# EAGLE schematic tester (EAGLE 6.6.0)

## Sheet 1 of 3
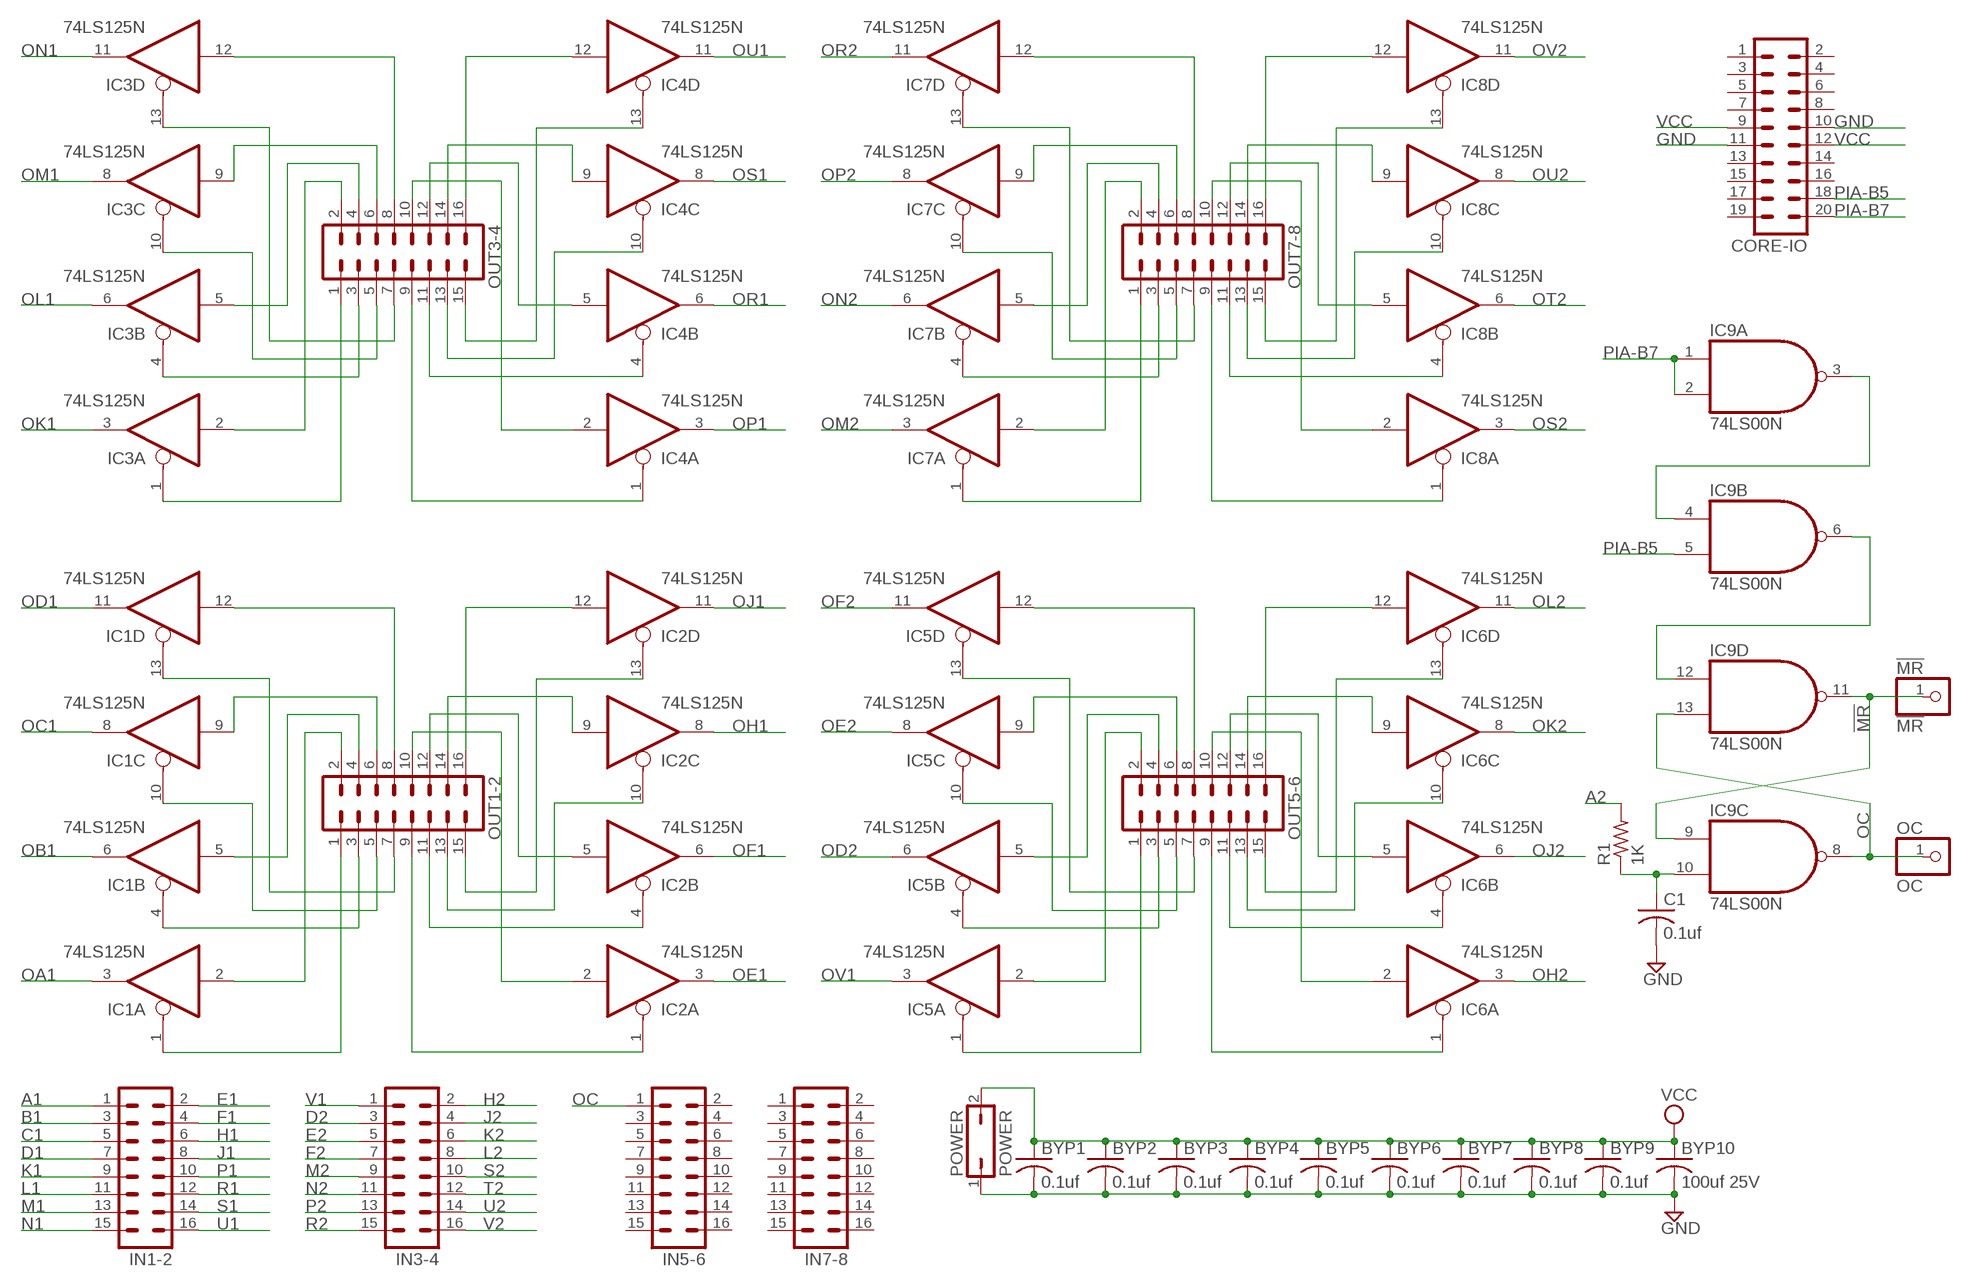
[diagram p0: schematic, sheet 1]

### Parts
!MR  !MR  PINHD-1X1  [1X01]
BYP1  0.1uf  C-US050-025X075  [C050-025X075]
BYP2  0.1uf  C-US050-025X075  [C050-025X075]
BYP3  0.1uf  C-US050-025X075  [C050-025X075]
BYP4  0.1uf  C-US050-025X075  [C050-025X075]
BYP5  0.1uf  C-US050-025X075  [C050-025X075]
BYP6  0.1uf  C-US050-025X075  [C050-025X075]
BYP7  0.1uf  C-US050-025X075  [C050-025X075]
BYP8  0.1uf  C-US050-025X075  [C050-025X075]
BYP9  0.1uf  C-US050-025X075  [C050-025X075]
BYP10  100uf 25V  C-US150-064X183  [C150-064X183]
C1  0.1uf  C-US050-025X075  [C050-025X075]
CORE-IO  MA10-2  [MA10-2]
IC1  74LS125N  [DIL14]
IC2  74LS125N  [DIL14]
IC3  74LS125N  [DIL14]
IC4  74LS125N  [DIL14]
IC5  74LS125N  [DIL14]
IC6  74LS125N  [DIL14]
IC7  74LS125N  [DIL14]
IC8  74LS125N  [DIL14]
IC9  74LS00N  [DIL14]
IN1-2  MA08-2  [MA08-2]
IN3-4  MA08-2  [MA08-2]
IN5-6  MA08-2  [MA08-2]
IN7-8  MA08-2  [MA08-2]
OC  OC  PINHD-1X1  [1X01]
OUT1-2  MA08-2  [MA08-2]
OUT3-4  MA08-2  [MA08-2]
OUT5-6  MA08-2  [MA08-2]
OUT7-8  MA08-2  [MA08-2]
POWER  POWER  JP1Q  [JP1]
R1  1K  R-US_0207/10  [0207/10]

### Nets
!MR: !MR.1 IC9.9(C:I0) IC9.11(D:O)
A1: IN1-2.1 ; also sheet 3
A2: R1.2 ; also sheet 3
B1: IN1-2.3 ; also sheet 3
C1: IN1-2.5 ; also sheet 3
D1: IN1-2.7 ; also sheet 3
D2: IN3-4.3 ; also sheet 3
E1: IN1-2.2 ; also sheet 3
E2: IN3-4.5 ; also sheet 3
F1: IN1-2.4 ; also sheet 3
F2: IN3-4.7 ; also sheet 3
GND [Power]: BYP1.2 BYP2.2 BYP3.2 BYP4.2 BYP5.2 BYP6.2 BYP7.2 BYP8.2 BYP9.2 BYP10.2 C1.2 CORE-IO.10 CORE-IO.11 POWER.1 ; also sheet 3
H1: IN1-2.6 ; also sheet 3
H2: IN3-4.2 ; also sheet 3
J1: IN1-2.8 ; also sheet 3
J2: IN3-4.4 ; also sheet 3
K1: IN1-2.9 ; also sheet 3
K2: IN3-4.6 ; also sheet 3
L1: IN1-2.11 ; also sheet 3
L2: IN3-4.8 ; also sheet 3
M1: IN1-2.13 ; also sheet 3
M2: IN3-4.9 ; also sheet 3
N1: IN1-2.15 ; also sheet 3
N2: IN3-4.11 ; also sheet 3
N$1: IC9.6(B:O) IC9.12(D:I0)
N$2: IC9.3(A:O) IC9.4(B:I0)
N$5: C1.1 IC9.10(C:I1) R1.1
N$53: IC1.1(A:OE) OUT1-2.1
N$54: IC1.4(B:OE) OUT1-2.3
N$55: IC1.10(C:OE) OUT1-2.5
N$56: IC1.13(D:OE) OUT1-2.7
N$57: IC1.2(A:I) OUT1-2.2
N$58: IC1.5(B:I) OUT1-2.4
N$59: IC1.9(C:I) OUT1-2.6
N$60: IC1.12(D:I) OUT1-2.8
N$61: IC5.4(B:OE) OUT5-6.3
N$62: IC2.10(C:OE) OUT1-2.13
N$63: IC2.4(B:OE) OUT1-2.11
N$64: IC2.1(A:OE) OUT1-2.9
N$65: IC2.2(A:I) OUT1-2.10
N$66: IC2.5(B:I) OUT1-2.12
N$67: IC2.9(C:I) OUT1-2.14
N$68: IC2.12(D:I) OUT1-2.16
N$138: IC5.13(D:OE) OUT5-6.7
N$139: IC2.13(D:OE) OUT1-2.15
N$140: IC5.2(A:I) OUT5-6.2
N$141: IC5.5(B:I) OUT5-6.4
N$142: IC5.9(C:I) OUT5-6.6
N$143: IC5.12(D:I) OUT5-6.8
N$144: IC6.10(C:OE) OUT5-6.13
N$145: IC6.4(B:OE) OUT5-6.11
N$146: IC6.1(A:OE) OUT5-6.9
N$147: IC6.2(A:I) OUT5-6.10
N$148: IC6.9(C:I) OUT5-6.14
N$149: IC6.12(D:I) OUT5-6.16
N$150: IC5.1(A:OE) OUT5-6.1
N$151: IC5.10(C:OE) OUT5-6.5
N$152: IC6.5(B:I) OUT5-6.12
N$153: IC6.13(D:OE) OUT5-6.15
N$154: IC3.4(B:OE) OUT3-4.3
N$155: IC3.13(D:OE) OUT3-4.7
N$156: IC3.2(A:I) OUT3-4.2
N$157: IC3.5(B:I) OUT3-4.4
N$158: IC3.9(C:I) OUT3-4.6
N$159: IC3.12(D:I) OUT3-4.8
N$160: IC4.10(C:OE) OUT3-4.13
N$161: IC4.4(B:OE) OUT3-4.11
N$162: IC4.1(A:OE) OUT3-4.9
N$163: IC4.2(A:I) OUT3-4.10
N$164: IC4.9(C:I) OUT3-4.14
N$165: IC4.12(D:I) OUT3-4.16
N$166: IC3.1(A:OE) OUT3-4.1
N$167: IC3.10(C:OE) OUT3-4.5
N$168: IC4.5(B:I) OUT3-4.12
N$169: IC4.13(D:OE) OUT3-4.15
N$170: IC7.4(B:OE) OUT7-8.3
N$171: IC7.13(D:OE) OUT7-8.7
N$172: IC7.2(A:I) OUT7-8.2
N$173: IC7.5(B:I) OUT7-8.4
N$174: IC7.9(C:I) OUT7-8.6
N$175: IC7.12(D:I) OUT7-8.8
N$176: IC8.10(C:OE) OUT7-8.13
N$177: IC8.4(B:OE) OUT7-8.11
N$178: IC8.1(A:OE) OUT7-8.9
N$179: IC8.2(A:I) OUT7-8.10
N$180: IC8.9(C:I) OUT7-8.14
N$181: IC8.12(D:I) OUT7-8.16
N$182: IC7.1(A:OE) OUT7-8.1
N$183: IC7.10(C:OE) OUT7-8.5
N$184: IC8.5(B:I) OUT7-8.12
N$185: IC8.13(D:OE) OUT7-8.15
OA1: IC1.3(A:O) ; also sheet 3
OB1: IC1.6(B:O) ; also sheet 3
OC: IC9.8(C:O) IC9.13(D:I1) IN5-6.1 OC.1
OC1: IC1.8(C:O) ; also sheet 3
OD1: IC1.11(D:O) ; also sheet 3
OD2: IC5.6(B:O) ; also sheet 3
OE1: IC2.3(A:O) ; also sheet 3
OE2: IC5.8(C:O) ; also sheet 3
OF1: IC2.6(B:O) ; also sheet 3
OF2: IC5.11(D:O) ; also sheet 3
OH1: IC2.8(C:O) ; also sheet 3
OH2: IC6.3(A:O) ; also sheet 3
OJ1: IC2.11(D:O) ; also sheet 3
OJ2: IC6.6(B:O) ; also sheet 3
OK1: IC3.3(A:O) ; also sheet 3
OK2: IC6.8(C:O) ; also sheet 3
OL1: IC3.6(B:O) ; also sheet 3
OL2: IC6.11(D:O) ; also sheet 3
OM1: IC3.8(C:O) ; also sheet 3
OM2: IC7.3(A:O) ; also sheet 3
ON1: IC3.11(D:O) ; also sheet 3
ON2: IC7.6(B:O) ; also sheet 3
OP1: IC4.3(A:O) ; also sheet 3
OP2: IC7.8(C:O) ; also sheet 3
OR1: IC4.6(B:O) ; also sheet 3
OR2: IC7.11(D:O) ; also sheet 3
OS1: IC4.8(C:O) ; also sheet 3
OS2: IC8.3(A:O) ; also sheet 3
OT2: IC8.6(B:O) ; also sheet 3
OU1: IC4.11(D:O) ; also sheet 3
OU2: IC8.8(C:O) ; also sheet 3
OV1: IC5.3(A:O) ; also sheet 3
OV2: IC8.11(D:O) ; also sheet 3
P1: IN1-2.10 ; also sheet 3
P2: IN3-4.13 ; also sheet 3
PIA-B5: CORE-IO.18 IC9.5(B:I1)
PIA-B7: CORE-IO.20 IC9.1(A:I0) IC9.2(A:I1)
R1: IN1-2.12 ; also sheet 3
R2: IN3-4.15 ; also sheet 3
S1: IN1-2.14 ; also sheet 3
S2: IN3-4.10 ; also sheet 3
T2: IN3-4.12 ; also sheet 3
U1: IN1-2.16 ; also sheet 3
U2: IN3-4.14 ; also sheet 3
V1: IN3-4.1 ; also sheet 3
V2: IN3-4.16 ; also sheet 3
VCC [Power]: BYP1.1 BYP2.1 BYP3.1 BYP4.1 BYP5.1 BYP6.1 BYP7.1 BYP8.1 BYP9.1 BYP10.1 CORE-IO.9 CORE-IO.12 POWER.2 ; also sheet 3
Unconnected: CORE-IO.1 CORE-IO.2 CORE-IO.3 CORE-IO.4 CORE-IO.5 CORE-IO.6 CORE-IO.7 CORE-IO.8 CORE-IO.13 CORE-IO.14 CORE-IO.15 CORE-IO.16 CORE-IO.17 CORE-IO.19 IN5-6.2 IN5-6.3 IN5-6.4 IN5-6.5 IN5-6.6 IN5-6.7 IN5-6.8 IN5-6.9 IN5-6.10 IN5-6.11 IN5-6.12 IN5-6.13 IN5-6.14 IN5-6.15 IN5-6.16 IN7-8.1 IN7-8.2 IN7-8.3 IN7-8.4 IN7-8.5 IN7-8.6 IN7-8.7 IN7-8.8 IN7-8.9 IN7-8.10 IN7-8.11 IN7-8.12 IN7-8.13 IN7-8.14 IN7-8.15 IN7-8.16

## Sheet 2 of 3
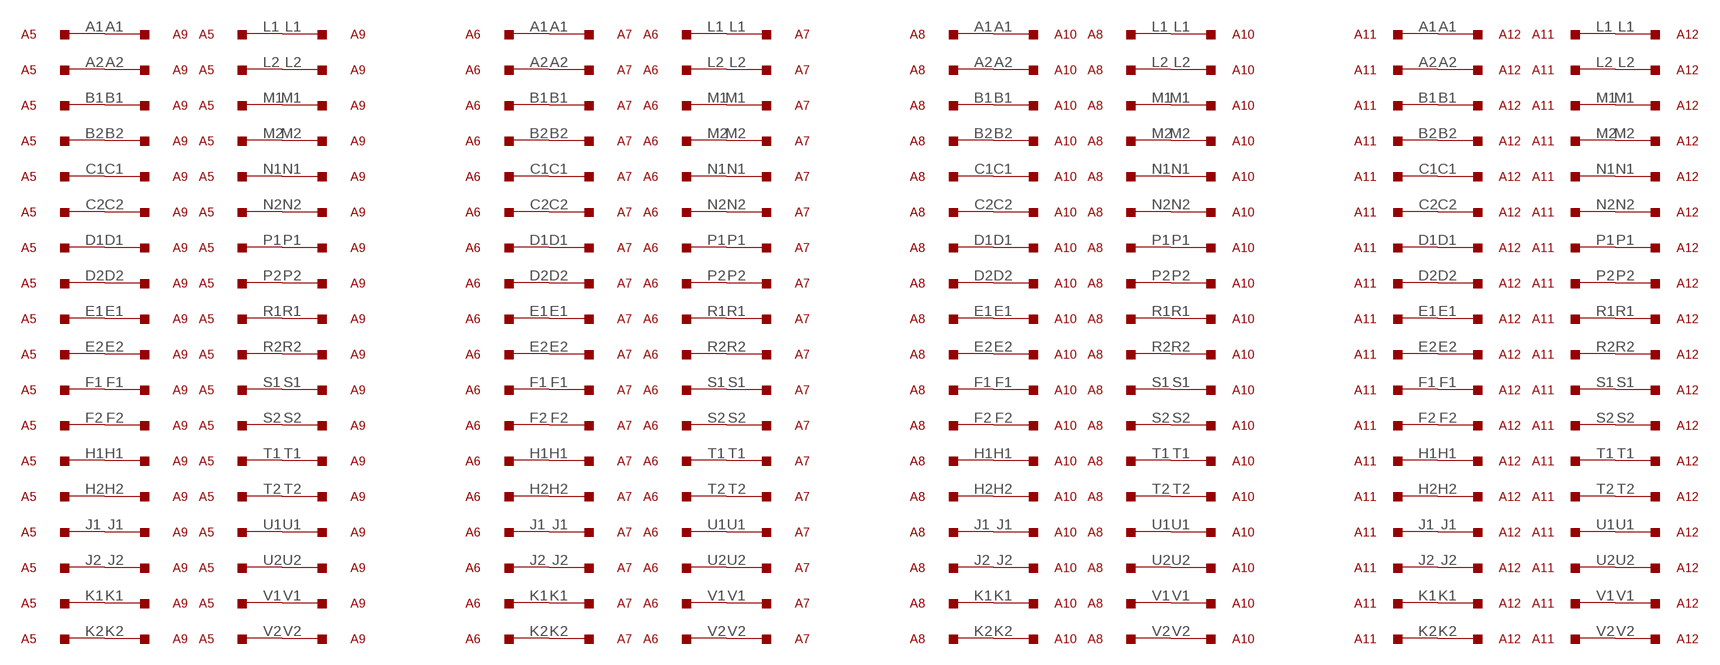
[diagram p1: schematic, sheet 2]

### Parts
A5  M916  [H807]
A6  M916  [H807]
A7  M916  [H807]
A8  M916  [H807]
A9  M916  [H807]
A10  M916  [H807]
A11  M916  [H807]
A12  M916  [H807]

### Nets
N$26: A5.L1 A9.L1
N$33: A5.L2 A9.L2
N$34: A5.M1 A9.M1
N$35: A5.M2 A9.M2
N$36: A5.N1 A9.N1
N$49: A5.N2 A9.N2
N$50: A5.P1 A9.P1
N$51: A5.P2 A9.P2
N$52: A5.R1 A9.R1
N$69: A5.R2 A9.R2
N$70: A5.S1 A9.S1
N$71: A5.S2 A9.S2
N$72: A5.T1 A9.T1
N$73: A5.T2 A9.T2
N$74: A5.U1 A9.U1
N$75: A5.U2 A9.U2
N$76: A5.V1 A9.V1
N$81: A5.V2 A9.V2
N$82: A5.A1 A9.A1
N$83: A5.A2 A9.A2
N$84: A5.B1 A9.B1
N$85: A5.B2 A9.B2
N$86: A5.C1 A9.C1
N$87: A5.C2 A9.C2
N$88: A5.D1 A9.D1
N$89: A5.D2 A9.D2
N$90: A5.E1 A9.E1
N$91: A5.E2 A9.E2
N$92: A5.F1 A9.F1
N$93: A5.F2 A9.F2
N$95: A5.H1 A9.H1
N$96: A5.H2 A9.H2
N$97: A5.J1 A9.J1
N$98: A5.J2 A9.J2
N$99: A5.K1 A9.K1
N$100: A5.K2 A9.K2
N$113: A6.L1 A7.L1
N$114: A6.L2 A7.L2
N$115: A6.M1 A7.M1
N$116: A6.M2 A7.M2
N$117: A6.N1 A7.N1
N$118: A6.N2 A7.N2
N$119: A6.P1 A7.P1
N$120: A6.P2 A7.P2
N$121: A6.R1 A7.R1
N$122: A6.R2 A7.R2
N$123: A6.S1 A7.S1
N$137: A6.S2 A7.S2
N$186: A6.T1 A7.T1
N$187: A6.T2 A7.T2
N$188: A6.U1 A7.U1
N$189: A6.U2 A7.U2
N$190: A6.V1 A7.V1
N$191: A6.V2 A7.V2
N$192: A6.A1 A7.A1
N$193: A6.A2 A7.A2
N$194: A6.B1 A7.B1
N$195: A6.B2 A7.B2
N$196: A6.C1 A7.C1
N$197: A6.C2 A7.C2
N$198: A6.D1 A7.D1
N$199: A6.D2 A7.D2
N$200: A6.E1 A7.E1
N$201: A6.E2 A7.E2
N$202: A6.F1 A7.F1
N$203: A6.F2 A7.F2
N$204: A6.H1 A7.H1
N$205: A6.H2 A7.H2
N$206: A6.J1 A7.J1
N$207: A6.J2 A7.J2
N$208: A6.K1 A7.K1
N$209: A6.K2 A7.K2
N$210: A8.L1 A10.L1
N$211: A8.L2 A10.L2
N$212: A8.M1 A10.M1
N$213: A8.M2 A10.M2
N$214: A8.N1 A10.N1
N$215: A8.N2 A10.N2
N$216: A8.P1 A10.P1
N$217: A8.P2 A10.P2
N$218: A8.R1 A10.R1
N$219: A8.R2 A10.R2
N$220: A8.S1 A10.S1
N$221: A8.S2 A10.S2
N$222: A8.T1 A10.T1
N$223: A8.T2 A10.T2
N$224: A8.U1 A10.U1
N$225: A8.U2 A10.U2
N$226: A8.V1 A10.V1
N$227: A8.V2 A10.V2
N$228: A8.A1 A10.A1
N$229: A8.A2 A10.A2
N$230: A8.B1 A10.B1
N$231: A8.B2 A10.B2
N$232: A8.C1 A10.C1
N$233: A8.C2 A10.C2
N$234: A8.D1 A10.D1
N$235: A8.D2 A10.D2
N$236: A8.E1 A10.E1
N$237: A8.E2 A10.E2
N$238: A8.F1 A10.F1
N$239: A8.F2 A10.F2
N$240: A8.H1 A10.H1
N$241: A8.H2 A10.H2
N$242: A8.J1 A10.J1
N$243: A8.J2 A10.J2
N$244: A8.K1 A10.K1
N$245: A8.K2 A10.K2
N$246: A11.L1 A12.L1
N$247: A11.L2 A12.L2
N$248: A11.M1 A12.M1
N$249: A11.M2 A12.M2
N$250: A11.N1 A12.N1
N$251: A11.N2 A12.N2
N$252: A11.P1 A12.P1
N$253: A11.P2 A12.P2
N$254: A11.R1 A12.R1
N$255: A11.R2 A12.R2
N$256: A11.S1 A12.S1
N$257: A11.S2 A12.S2
N$258: A11.T1 A12.T1
N$259: A11.T2 A12.T2
N$260: A11.U1 A12.U1
N$261: A11.U2 A12.U2
N$262: A11.V1 A12.V1
N$263: A11.V2 A12.V2
N$264: A11.A1 A12.A1
N$265: A11.A2 A12.A2
N$266: A11.B1 A12.B1
N$267: A11.B2 A12.B2
N$268: A11.C1 A12.C1
N$269: A11.C2 A12.C2
N$270: A11.D1 A12.D1
N$271: A11.D2 A12.D2
N$272: A11.E1 A12.E1
N$273: A11.E2 A12.E2
N$274: A11.F1 A12.F1
N$275: A11.F2 A12.F2
N$276: A11.H1 A12.H1
N$277: A11.H2 A12.H2
N$278: A11.J1 A12.J1
N$279: A11.J2 A12.J2
N$280: A11.K1 A12.K1
N$281: A11.K2 A12.K2

## Sheet 3 of 3
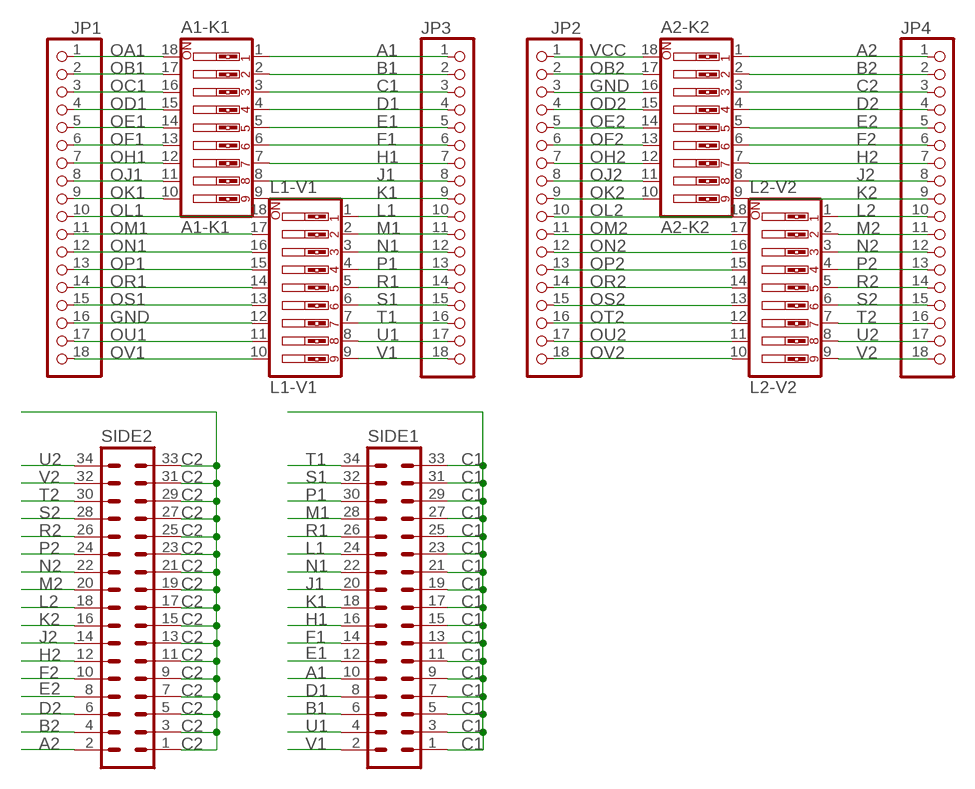
[diagram p2: schematic, sheet 3]

### Parts
A1-K1  A1-K1  SW_DIP-9  [EDG-09]
A2-K2  A2-K2  SW_DIP-9  [EDG-09]
JP1  PINHD-1X18  [1X18]
JP2  PINHD-1X18  [1X18]
JP3  PINHD-1X18  [1X18]
JP4  PINHD-1X18  [1X18]
L1-V1  L1-V1  SW_DIP-9  [EDG-09]
L2-V2  L2-V2  SW_DIP-9  [EDG-09]
SIDE1  MA17-2  [MA17-2]
SIDE2  MA17-2  [MA17-2]

### Nets
A1: A1-K1.1 JP3.1 SIDE1.10 ; also sheet 1
A2: A2-K2.1 JP4.1 SIDE2.2 ; also sheet 1
B1: A1-K1.2 JP3.2 SIDE1.6 ; also sheet 1
B2: A2-K2.2 JP4.2 SIDE2.4
C1: A1-K1.3 JP3.3 SIDE1.1 SIDE1.3 SIDE1.5 SIDE1.7 SIDE1.9 SIDE1.11 SIDE1.13 SIDE1.15 SIDE1.17 SIDE1.19 SIDE1.21 SIDE1.23 SIDE1.25 SIDE1.27 SIDE1.29 SIDE1.31 SIDE1.33 ; also sheet 1
C2: A2-K2.3 JP4.3 SIDE2.1 SIDE2.3 SIDE2.5 SIDE2.7 SIDE2.9 SIDE2.11 SIDE2.13 SIDE2.15 SIDE2.17 SIDE2.19 SIDE2.21 SIDE2.23 SIDE2.25 SIDE2.27 SIDE2.29 SIDE2.31 SIDE2.33
D1: A1-K1.4 JP3.4 SIDE1.8 ; also sheet 1
D2: A2-K2.4 JP4.4 SIDE2.6 ; also sheet 1
E1: A1-K1.5 JP3.5 SIDE1.12 ; also sheet 1
E2: A2-K2.5 JP4.5 SIDE2.8 ; also sheet 1
F1: A1-K1.6 JP3.6 SIDE1.14 ; also sheet 1
F2: A2-K2.6 JP4.6 SIDE2.10 ; also sheet 1
GND [Power]: A2-K2.16 JP1.16 JP2.3 L1-V1.12 ; also sheet 1
H1: A1-K1.7 JP3.7 SIDE1.16 ; also sheet 1
H2: A2-K2.7 JP4.7 SIDE2.12 ; also sheet 1
J1: A1-K1.8 JP3.8 SIDE1.20 ; also sheet 1
J2: A2-K2.8 JP4.8 SIDE2.14 ; also sheet 1
K1: A1-K1.9 JP3.9 SIDE1.18 ; also sheet 1
K2: A2-K2.9 JP4.9 SIDE2.16 ; also sheet 1
L1: JP3.10 L1-V1.1 SIDE1.24 ; also sheet 1
L2: JP4.10 L2-V2.1 SIDE2.18 ; also sheet 1
M1: JP3.11 L1-V1.2 SIDE1.28 ; also sheet 1
M2: JP4.11 L2-V2.2 SIDE2.20 ; also sheet 1
N1: JP3.12 L1-V1.3 SIDE1.22 ; also sheet 1
N2: JP4.12 L2-V2.3 SIDE2.22 ; also sheet 1
OA1: A1-K1.18 JP1.1 ; also sheet 1
OB1: A1-K1.17 JP1.2 ; also sheet 1
OB2: A2-K2.17 JP2.2
OC1: A1-K1.16 JP1.3 ; also sheet 1
OD1: A1-K1.15 JP1.4 ; also sheet 1
OD2: A2-K2.15 JP2.4 ; also sheet 1
OE1: A1-K1.14 JP1.5 ; also sheet 1
OE2: A2-K2.14 JP2.5 ; also sheet 1
OF1: A1-K1.13 JP1.6 ; also sheet 1
OF2: A2-K2.13 JP2.6 ; also sheet 1
OH1: A1-K1.12 JP1.7 ; also sheet 1
OH2: A2-K2.12 JP2.7 ; also sheet 1
OJ1: A1-K1.11 JP1.8 ; also sheet 1
OJ2: A2-K2.11 JP2.8 ; also sheet 1
OK1: A1-K1.10 JP1.9 ; also sheet 1
OK2: A2-K2.10 JP2.9 ; also sheet 1
OL1: JP1.10 L1-V1.18 ; also sheet 1
OL2: JP2.10 L2-V2.18 ; also sheet 1
OM1: JP1.11 L1-V1.17 ; also sheet 1
OM2: JP2.11 L2-V2.17 ; also sheet 1
ON1: JP1.12 L1-V1.16 ; also sheet 1
ON2: JP2.12 L2-V2.16 ; also sheet 1
OP1: JP1.13 L1-V1.15 ; also sheet 1
OP2: JP2.13 L2-V2.15 ; also sheet 1
OR1: JP1.14 L1-V1.14 ; also sheet 1
OR2: JP2.14 L2-V2.14 ; also sheet 1
OS1: JP1.15 L1-V1.13 ; also sheet 1
OS2: JP2.15 L2-V2.13 ; also sheet 1
OT2: JP2.16 L2-V2.12 ; also sheet 1
OU1: JP1.17 L1-V1.11 ; also sheet 1
OU2: JP2.17 L2-V2.11 ; also sheet 1
OV1: JP1.18 L1-V1.10 ; also sheet 1
OV2: JP2.18 L2-V2.10 ; also sheet 1
P1: JP3.13 L1-V1.4 SIDE1.30 ; also sheet 1
P2: JP4.13 L2-V2.4 SIDE2.24 ; also sheet 1
R1: JP3.14 L1-V1.5 SIDE1.26 ; also sheet 1
R2: JP4.14 L2-V2.5 SIDE2.26 ; also sheet 1
S1: JP3.15 L1-V1.6 SIDE1.32 ; also sheet 1
S2: JP4.15 L2-V2.6 SIDE2.28 ; also sheet 1
T1: JP3.16 L1-V1.7 SIDE1.34
T2: JP4.16 L2-V2.7 SIDE2.30 ; also sheet 1
U1: JP3.17 L1-V1.8 SIDE1.4 ; also sheet 1
U2: JP4.17 L2-V2.8 SIDE2.34 ; also sheet 1
V1: JP3.18 L1-V1.9 SIDE1.2 ; also sheet 1
V2: JP4.18 L2-V2.9 SIDE2.32 ; also sheet 1
VCC [Power]: A2-K2.18 JP2.1 ; also sheet 1

## Power pins joined to a net without a drawn wire
GND: IC1.7(P:GND) IC2.7(P:GND) IC3.7(P:GND) IC4.7(P:GND) IC5.7(P:GND) IC6.7(P:GND) IC7.7(P:GND) IC8.7(P:GND) IC9.7(P:GND)
VCC: IC1.14(P:VCC) IC2.14(P:VCC) IC3.14(P:VCC) IC4.14(P:VCC) IC5.14(P:VCC) IC6.14(P:VCC) IC7.14(P:VCC) IC8.14(P:VCC) IC9.14(P:VCC)

## Library data of the parts
!MR OC = pinhead:PINHD-1X1: PIN HEADER
A1-K1 A2-K2 L1-V1 L2-V2 = special:SW_DIP-9: DIP SWITCH
A5-A12 = dec-m:M916: Simple 36 pin connector/wire cable
BYP1-BYP10 C1 = rcl:C-US: CAPACITOR, American symbol
CORE-IO = con-lstb:MA10-2: PIN HEADER; OC_FARNELL: unknown; OC_NEWARK: unknown
IC1-IC8 = 74xx-us:74*125: Quad bus BUFFER, 3-state
IC9 = 74xx-us:74*00: Quad 2-input NAND gate
IN1-2 IN3-4 IN5-6 IN7-8 OUT1-2 OUT3-4 OUT5-6 OUT7-8 = con-lstb:MA08-2: PIN HEADER; OC_FARNELL: unknown; OC_NEWARK: unknown
JP1-JP4 = pinhead:PINHD-1X18: PIN HEADER
POWER = jumper:JP1Q: JUMPER
R1 = rcl:R-US_: RESISTOR, American symbol
SIDE1 SIDE2 = con-lstb:MA17-2: PIN HEADER; OC_FARNELL: unknown; OC_NEWARK: unknown

## Net classes
1 Power: width 0.508 mm, drill 0.254 mm, clearance 0.254 mm